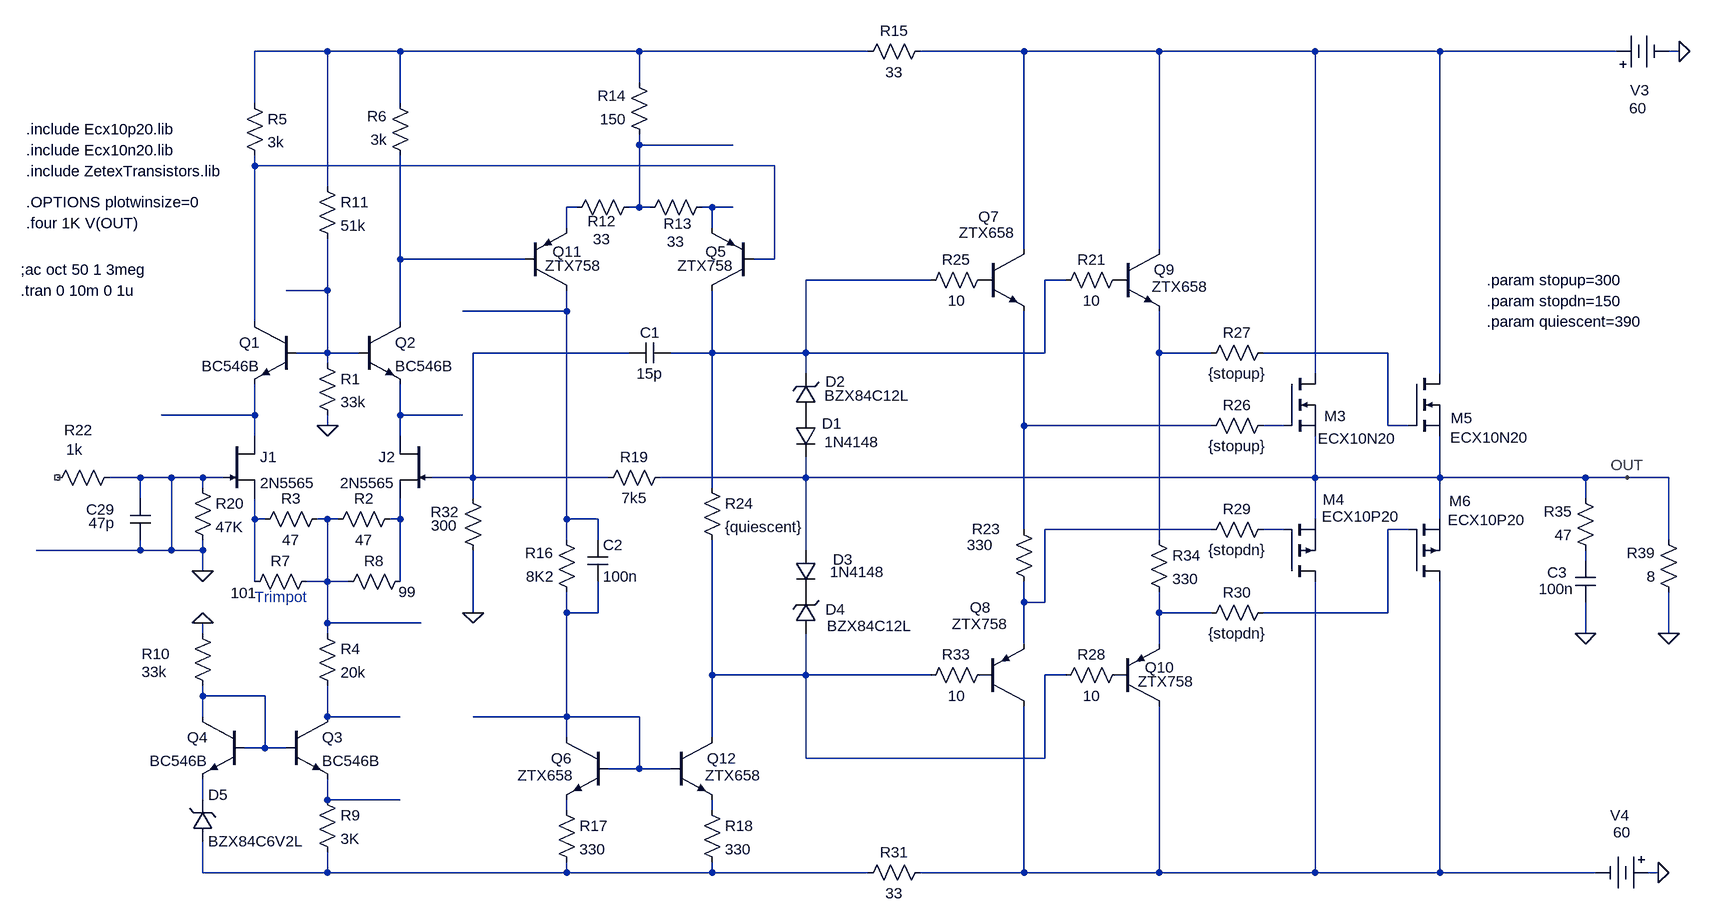
[diagram p0: schematic Zetex version amp 01.asc]
Zetex version amp 01.asc, the LTspice schematic file:
Version 4
SHEET 1 5568 1120
WIRE -224 -704 -336 -704
WIRE -112 -704 -224 -704
WIRE 256 -704 -112 -704
WIRE 608 -704 256 -704
WIRE 848 -704 688 -704
WIRE 1056 -704 848 -704
WIRE 1296 -704 1056 -704
WIRE 1488 -704 1296 -704
WIRE 1760 -704 1488 -704
WIRE 1856 -704 1840 -704
WIRE 256 -656 256 -704
WIRE -336 -624 -336 -704
WIRE -112 -624 -112 -704
WIRE 256 -560 256 -576
WIRE 400 -560 256 -560
WIRE -336 -528 -336 -544
WIRE 464 -528 -336 -528
WIRE -224 -496 -224 -704
WIRE 160 -464 144 -464
WIRE 256 -464 256 -560
WIRE 256 -464 240 -464
WIRE 272 -464 256 -464
WIRE 368 -464 352 -464
WIRE 400 -464 368 -464
WIRE 144 -432 144 -464
WIRE 368 -432 368 -464
WIRE 848 -400 848 -704
WIRE 1056 -400 1056 -704
WIRE -112 -384 -112 -544
WIRE 80 -384 -112 -384
WIRE 464 -384 464 -528
WIRE 464 -384 432 -384
WIRE 704 -352 512 -352
WIRE 912 -352 880 -352
WIRE -224 -336 -224 -416
WIRE -224 -336 -288 -336
WIRE 144 -304 144 -336
WIRE 144 -304 -16 -304
WIRE -336 -288 -336 -528
WIRE -112 -288 -112 -384
WIRE -224 -240 -224 -336
WIRE -224 -240 -272 -240
WIRE -176 -240 -224 -240
WIRE 240 -240 0 -240
WIRE 368 -240 368 -336
WIRE 368 -240 304 -240
WIRE 512 -240 512 -352
WIRE 512 -240 368 -240
WIRE 880 -240 880 -352
WIRE 880 -240 512 -240
WIRE 1056 -240 1056 -304
WIRE 1136 -240 1056 -240
WIRE 1408 -240 1216 -240
WIRE -224 -224 -224 -240
WIRE 512 -208 512 -240
WIRE 1296 -208 1296 -704
WIRE 1488 -208 1488 -704
WIRE -336 -144 -336 -192
WIRE -336 -144 -480 -144
WIRE -112 -144 -112 -192
WIRE -16 -144 -112 -144
WIRE -224 -128 -224 -144
WIRE 848 -128 848 -304
WIRE 1136 -128 848 -128
WIRE 1248 -128 1216 -128
WIRE 1408 -128 1408 -240
WIRE 1440 -128 1408 -128
WIRE -336 -112 -336 -144
WIRE -112 -112 -112 -144
WIRE -512 -48 -560 -48
WIRE -464 -48 -512 -48
WIRE -416 -48 -464 -48
WIRE -384 -48 -416 -48
WIRE 0 -48 0 -240
WIRE 0 -48 -64 -48
WIRE 208 -48 0 -48
WIRE 512 -48 512 -80
WIRE 512 -48 288 -48
WIRE 1296 -48 1296 -112
WIRE 1296 -48 512 -48
WIRE 1488 -48 1488 -112
WIRE 1488 -48 1296 -48
WIRE 1712 -48 1488 -48
WIRE 1776 -48 1712 -48
WIRE 1840 -48 1776 -48
WIRE -416 -32 -416 -48
WIRE 368 -32 368 -240
WIRE -512 -16 -512 -48
WIRE 0 -16 0 -48
WIRE 1712 -16 1712 -48
WIRE -336 16 -336 -16
WIRE -320 16 -336 16
WIRE -224 16 -240 16
WIRE -208 16 -224 16
WIRE -112 16 -112 -16
WIRE -112 16 -128 16
WIRE 144 16 144 -304
WIRE 192 16 144 16
WIRE 1296 16 1296 -48
WIRE 1488 16 1488 -48
WIRE 848 32 848 -128
WIRE 1136 32 880 32
WIRE 1248 32 1216 32
WIRE 1440 32 1408 32
WIRE 144 48 144 16
WIRE 192 48 192 16
WIRE 1056 48 1056 -240
WIRE 1840 48 1840 -48
WIRE -512 64 -512 48
WIRE -512 64 -672 64
WIRE -464 64 -464 -48
WIRE -464 64 -512 64
WIRE -416 64 -416 48
WIRE -416 64 -464 64
WIRE 512 64 512 -48
WIRE 1712 80 1712 64
WIRE -416 96 -416 64
WIRE -336 112 -336 16
WIRE -224 112 -224 16
WIRE -224 112 -256 112
WIRE -192 112 -224 112
WIRE -112 112 -112 16
WIRE 848 144 848 112
WIRE 880 144 880 32
WIRE 880 144 848 144
WIRE 0 160 0 64
WIRE 144 160 144 128
WIRE 192 160 192 112
WIRE 192 160 144 160
WIRE 1056 160 1056 128
WIRE 1136 160 1056 160
WIRE 1408 160 1408 32
WIRE 1408 160 1216 160
WIRE -224 176 -224 112
WIRE -80 176 -224 176
WIRE -416 192 -416 176
WIRE -224 192 -224 176
WIRE 1712 192 1712 144
WIRE 1840 192 1840 128
WIRE 848 208 848 144
WIRE 1056 208 1056 160
WIRE 368 256 368 48
WIRE 512 256 512 192
WIRE 512 256 368 256
WIRE 704 256 512 256
WIRE 912 256 880 256
WIRE -416 288 -416 272
WIRE -320 288 -416 288
WIRE -416 320 -416 288
WIRE -224 320 -224 272
WIRE -112 320 -224 320
WIRE 144 320 144 160
WIRE 144 320 0 320
WIRE 256 320 144 320
WIRE 144 352 144 320
WIRE 368 352 368 256
WIRE -320 368 -320 288
WIRE -320 368 -352 368
WIRE -288 368 -320 368
WIRE 512 384 512 256
WIRE 880 384 880 256
WIRE 880 384 512 384
WIRE 256 400 256 320
WIRE 256 400 208 400
WIRE 304 400 256 400
WIRE -416 448 -416 416
WIRE -224 448 -224 416
WIRE -112 448 -224 448
WIRE 144 464 144 448
WIRE 368 464 368 448
WIRE -416 560 -416 512
WIRE -224 560 -224 528
WIRE -224 560 -416 560
WIRE 144 560 144 544
WIRE 144 560 -224 560
WIRE 368 560 368 544
WIRE 368 560 144 560
WIRE 608 560 368 560
WIRE 848 560 848 304
WIRE 848 560 688 560
WIRE 1056 560 1056 304
WIRE 1056 560 848 560
WIRE 1296 560 1296 112
WIRE 1296 560 1056 560
WIRE 1488 560 1488 112
WIRE 1488 560 1296 560
WIRE 1728 560 1488 560
WIRE 1824 560 1808 560
FLAG -224 -128 0
FLAG -416 176 0
FLAG -416 96 0
FLAG 1856 -704 0
FLAG 1824 560 0
FLAG 1840 192 0
FLAG 0 160 0
FLAG 1776 -48 OUT
FLAG 1712 192 0
DATAFLAG 352 -704 ""
DATAFLAG 528 560 ""
DATAFLAG -144 320 ""
DATAFLAG 48 320 ""
DATAFLAG -144 448 ""
DATAFLAG -320 288 ""
DATAFLAG -112 176 ""
DATAFLAG 96 -48 ""
DATAFLAG -32 -144 ""
DATAFLAG -432 -144 ""
DATAFLAG 16 -528 ""
DATAFLAG -16 -384 ""
DATAFLAG -256 -336 ""
DATAFLAG 592 256 ""
DATAFLAG 640 -240 ""
DATAFLAG 944 -128 ""
DATAFLAG 960 32 ""
DATAFLAG 64 -304 ""
DATAFLAG 336 -560 ""
DATAFLAG 144 -464 ""
DATAFLAG 384 -464 ""
SYMBOL njf -64 -112 M0
SYMATTR InstName J2
SYMATTR Value 2N5565
SYMBOL npn -272 -288 M0
SYMATTR InstName Q1
SYMATTR Value BC546B
SYMBOL res -240 -240 R0
SYMATTR InstName R1
SYMATTR Value 33k
SYMBOL res -112 0 R90
WINDOW 0 0 56 VBottom 2
WINDOW 3 32 56 VTop 2
SYMATTR InstName R2
SYMATTR Value 47
SYMBOL res -224 0 R90
WINDOW 0 0 56 VBottom 2
WINDOW 3 32 56 VTop 2
SYMATTR InstName R3
SYMATTR Value 47
SYMBOL res -240 176 R0
SYMATTR InstName R4
SYMATTR Value 20k
SYMBOL res -352 -640 R0
SYMATTR InstName R5
SYMATTR Value 3k
SYMBOL res -96 -528 R180
WINDOW 0 36 76 Left 2
WINDOW 3 36 40 Left 2
SYMATTR InstName R6
SYMATTR Value 3k
SYMBOL res -240 96 R90
WINDOW 0 0 56 VBottom 2
WINDOW 3 18 113 VTop 2
SYMATTR InstName R7
SYMATTR Value 101
SYMBOL res -96 96 R90
WINDOW 0 0 56 VBottom 2
WINDOW 3 16 5 VTop 2
SYMATTR InstName R8
SYMATTR Value 99
SYMBOL npn -288 320 R0
SYMATTR InstName Q3
SYMATTR Value BC546B
SYMBOL res -240 432 R0
SYMATTR InstName R9
SYMATTR Value 3K
SYMBOL res -432 176 R0
WINDOW 0 -78 47 Left 2
WINDOW 3 -78 75 Left 2
SYMATTR InstName R10
SYMATTR Value 33k
SYMBOL res -240 -512 R0
SYMATTR InstName R11
SYMATTR Value 51k
SYMBOL res 256 -480 R90
WINDOW 0 53 58 VBottom 2
WINDOW 3 49 58 VTop 2
SYMATTR InstName R12
SYMATTR Value 33
SYMBOL res 256 -448 R270
WINDOW 0 -25 59 VTop 2
WINDOW 3 -21 56 VBottom 2
SYMATTR InstName R13
SYMATTR Value 33
SYMBOL res 272 -560 R180
WINDOW 0 36 76 Left 2
WINDOW 3 36 40 Left 2
SYMATTR InstName R14
SYMATTR Value 150
SYMBOL res 160 144 R180
WINDOW 0 36 76 Left 2
WINDOW 3 36 40 Left 2
SYMATTR InstName R16
SYMATTR Value 8K2
SYMBOL res 128 448 R0
SYMATTR InstName R17
SYMATTR Value 330
SYMBOL res 352 448 R0
SYMATTR InstName R18
SYMATTR Value 330
SYMBOL res 304 -64 R90
WINDOW 0 0 56 VBottom 2
WINDOW 3 32 56 VTop 2
SYMATTR InstName R19
SYMATTR Value 7k5
SYMBOL res -432 -48 R0
SYMATTR InstName R20
SYMATTR Value 47K
SYMBOL res -544 -64 R90
WINDOW 0 -42 63 VBottom 2
WINDOW 3 -43 69 VTop 2
SYMATTR InstName R22
SYMATTR Value 1k
SYMBOL res 832 16 R0
WINDOW 0 -64 15 Left 2
WINDOW 3 -72 40 Left 2
SYMATTR InstName R23
SYMATTR Value 330
SYMBOL res 352 -48 R0
SYMATTR InstName R24
SYMATTR Value {quiescent}
SYMBOL res 1120 -112 R270
WINDOW 0 32 56 VTop 2
WINDOW 3 0 56 VBottom 2
SYMATTR InstName R26
SYMATTR Value {stopup}
SYMBOL res 1120 -224 R270
WINDOW 0 32 56 VTop 2
WINDOW 3 0 56 VBottom 2
SYMATTR InstName R27
SYMATTR Value {stopup}
SYMBOL res 1120 48 R270
WINDOW 0 32 56 VTop 2
WINDOW 3 0 56 VBottom 2
SYMATTR InstName R29
SYMATTR Value {stopdn}
SYMBOL res 1120 176 R270
WINDOW 0 32 56 VTop 2
WINDOW 3 0 56 VBottom 2
SYMATTR InstName R30
SYMATTR Value {stopdn}
SYMBOL Misc\\battery 1744 -704 R270
WINDOW 123 0 0 Left 2
WINDOW 39 0 0 Left 2
WINDOW 0 -60 37 VRight 2
WINDOW 3 -87 35 VRight 2
SYMATTR InstName V3
SYMATTR Value 60
SYMBOL Misc\\battery 1824 560 R90
WINDOW 123 0 0 Left 2
WINDOW 39 0 0 Left 2
WINDOW 0 -88 45 VRight 2
WINDOW 3 -62 42 VRight 2
SYMATTR InstName V4
SYMATTR Value 60
SYMBOL njf -384 -112 R0
SYMATTR InstName J1
SYMATTR Value 2N5565
SYMBOL npn -352 320 M0
SYMATTR InstName Q4
SYMATTR Value BC546B
SYMBOL res 1856 144 R180
WINDOW 0 36 76 Left 2
WINDOW 3 36 40 Left 2
SYMATTR InstName R39
SYMATTR Value 8
SYMBOL npn -176 -288 R0
SYMATTR InstName Q2
SYMATTR Value BC546B
SYMBOL nmos 1248 -208 R0
WINDOW 3 52 100 Left 2
WINDOW 0 62 65 Left 2
SYMATTR Value ECX10N20
SYMATTR InstName M3
SYMATTR Prefix X
SYMBOL nmos 1440 -208 R0
WINDOW 0 65 68 Left 2
WINDOW 3 64 98 Left 2
SYMATTR InstName M5
SYMATTR Value ECX10N20
SYMATTR Prefix X
SYMBOL pmos 1248 112 M180
WINDOW 0 60 126 Left 2
WINDOW 3 58 100 Left 2
SYMATTR InstName M4
SYMATTR Value ECX10P20
SYMATTR Prefix X
SYMBOL pmos 1440 112 M180
WINDOW 0 62 124 Left 2
WINDOW 3 60 95 Left 2
SYMATTR InstName M6
SYMATTR Value ECX10P20
SYMATTR Prefix X
SYMBOL cap -496 48 R180
WINDOW 0 55 47 Left 2
WINDOW 3 55 26 Left 2
SYMATTR InstName C29
SYMATTR Value 47p
SYMBOL zener -432 512 M180
WINDOW 0 24 72 Left 2
WINDOW 3 24 0 Left 2
SYMATTR InstName D5
SYMATTR Value BZX84C6V2L
SYMATTR Description Diode
SYMATTR Type diode
SYMBOL res 704 -720 R90
WINDOW 0 0 56 VBottom 2
WINDOW 3 32 56 VTop 2
SYMATTR InstName R15
SYMATTR Value 33
SYMBOL res 704 544 R90
WINDOW 0 0 56 VBottom 2
WINDOW 3 32 56 VTop 2
SYMATTR InstName R31
SYMATTR Value 33
SYMBOL pnp 80 -336 M180
WINDOW 0 42 60 Left 2
WINDOW 3 31 38 Left 2
SYMATTR InstName Q11
SYMATTR Value ZTX758
SYMBOL npn 304 352 R0
WINDOW 3 53 58 Left 2
SYMATTR Value ZTX658
SYMATTR InstName Q12
SYMBOL diode 496 -144 R0
WINDOW 0 41 13 Left 2
WINDOW 3 45 41 Left 2
SYMATTR InstName D1
SYMATTR Value 1N4148
SYMBOL zener 528 -144 R180
WINDOW 0 -45 52 Left 2
WINDOW 3 -144 30 Left 2
SYMATTR InstName D2
SYMATTR Value BZX84C12L
SYMATTR Description Diode
SYMATTR Type diode
SYMBOL diode 496 64 R0
WINDOW 0 58 14 Left 2
WINDOW 3 53 33 Left 2
SYMATTR InstName D3
SYMATTR Value 1N4148
SYMBOL zener 528 192 R180
WINDOW 0 -45 37 Left 2
WINDOW 3 -148 12 Left 2
SYMATTR InstName D4
SYMATTR Value BZX84C12L
SYMATTR Description Diode
SYMATTR Type diode
SYMBOL res 16 80 R180
WINDOW 0 37 75 Left 2
WINDOW 3 40 54 Left 2
SYMATTR InstName R32
SYMATTR Value 300
SYMBOL pnp 432 -336 R180
WINDOW 0 42 60 Left 2
WINDOW 3 31 38 Left 2
SYMATTR InstName Q5
SYMATTR Value ZTX758
SYMBOL npn 208 352 M0
WINDOW 3 53 58 Left 2
SYMATTR Value ZTX658
SYMATTR InstName Q6
SYMBOL npn 784 -400 R0
WINDOW 3 -36 -25 Left 2
WINDOW 0 -6 -50 Left 2
SYMATTR Value ZTX658
SYMATTR InstName Q7
SYMBOL pnp 784 304 M180
WINDOW 0 -19 152 Left 2
WINDOW 3 -47 127 Left 2
SYMATTR InstName Q8
SYMATTR Value ZTX758
SYMBOL cap 304 -256 R90
WINDOW 0 0 32 VBottom 2
WINDOW 3 32 32 VTop 2
SYMATTR InstName C1
SYMATTR Value 15p
SYMBOL cap 176 48 R0
SYMATTR InstName C2
SYMATTR Value 100n
SYMBOL res 1008 -368 R90
WINDOW 0 0 56 VBottom 2
WINDOW 3 32 56 VTop 2
SYMATTR InstName R21
SYMATTR Value 10
SYMBOL npn 992 -400 R0
WINDOW 3 53 58 Left 2
SYMATTR Value ZTX658
SYMATTR InstName Q9
SYMBOL res 800 -368 R90
WINDOW 0 0 56 VBottom 2
WINDOW 3 32 56 VTop 2
SYMATTR InstName R25
SYMATTR Value 10
SYMBOL pnp 992 304 M180
WINDOW 0 42 60 Left 2
WINDOW 3 31 38 Left 2
SYMATTR InstName Q10
SYMATTR Value ZTX758
SYMBOL res 1008 240 R90
WINDOW 0 0 56 VBottom 2
WINDOW 3 32 56 VTop 2
SYMATTR InstName R28
SYMATTR Value 10
SYMBOL res 800 240 R90
WINDOW 0 0 56 VBottom 2
WINDOW 3 32 56 VTop 2
SYMATTR InstName R33
SYMATTR Value 10
SYMBOL res 1040 32 R0
SYMATTR InstName R34
SYMATTR Value 330
SYMBOL res 1728 80 R180
WINDOW 0 36 76 Left 2
WINDOW 3 36 40 Left 2
SYMATTR InstName R35
SYMATTR Value 47
SYMBOL cap 1696 80 R0
WINDOW 0 -43 18 Left 2
WINDOW 3 -56 43 Left 2
SYMATTR InstName C3
SYMATTR Value 100n
TEXT -696 -368 Left 2 !;ac oct 50 1 3meg
TEXT -696 -336 Left 2 !.tran 0 10m 0 1u
TEXT -688 -520 Left 2 !.include ZetexTransistors.lib
TEXT 1560 -352 Left 2 !.param stopup=300
TEXT 1560 -320 Left 2 !.param stopdn=150
TEXT 1560 -288 Left 2 !.param quiescent=390
TEXT -688 -552 Left 2 !.include Ecx10n20.lib
TEXT -688 -584 Left 2 !.include Ecx10p20.lib
TEXT -688 -440 Left 2 !.four 1K V(OUT)
TEXT -688 -472 Left 2 !.OPTIONS plotwinsize=0
TEXT -336 136 Left 2 ;Trimpot

The netlist it stands for:
* Zetex version amp 01.asc
J2 N015 N011 N020 2N5565
Q1 N004 N009 N014 0 BC546B
R1 N009 0 33k
R2 N020 N019 47
R3 N019 N018 47
R4 N019 N029 20k
R5 N001 N004 3k
R6 N007 N001 3k
R7 N019 N018 101
R8 N020 N019 99
Q3 N029 N028 N031 0 BC546B
R9 N031 N034 3K
R10 0 N028 33k
R11 N001 N009 51k
R12 N003 N005 33
R13 N003 N006 33
R14 N003 N001 150
R16 N025 N010 8K2
R17 N032 N034 330
R18 N033 N034 330
R19 OUT N011 7k5
R20 0 0 47K
R22 0 NC_01 1k
R23 N016 N021 330
R24 N008 N027 {quiescent}
R26 N016 N017 {stopup}
R27 N012 N013 {stopup}
R29 N021 N022 {stopdn}
R30 N026 N023 {stopdn}
V3 N002 0 60
V4 0 N035 60
J1 N014 0 N018 2N5565
Q4 N028 N028 N030 0 BC546B
R39 0 OUT 8
Q2 N007 N009 N015 0 BC546B
XM3 N002 N017 OUT ECX10N20  ; pins D G S
XM5 N002 N013 OUT ECX10N20  ; pins D G S
XM4 N035 N022 OUT ECX10P20  ; pins D G S
XM6 N035 N023 OUT ECX10P20  ; pins D G S
C29 0 0 47p
D5 N034 N030 BZX84C6V2L
R15 N002 N001 33
R31 N035 N034 33
Q11 N010 N007 N005 0 ZTX758
Q12 N027 N025 N033 0 ZTX658
D1 P001 OUT 1N4148
D2 P001 N008 BZX84C12L
D3 OUT P002 1N4148
D4 N027 P002 BZX84C12L
R32 0 N011 300
Q5 N008 N004 N006 0 ZTX758
Q6 N025 N025 N032 0 ZTX658
Q7 N002 P003 N016 0 ZTX658
Q8 N035 P004 N021 0 ZTX758
C1 N008 N011 15p
C2 N010 N025 100n
R21 P005 N008 10
Q9 N002 P005 N012 0 ZTX658
R25 P003 N008 10
Q10 N035 P006 N026 0 ZTX758
R28 P006 N027 10
R33 P004 N027 10
R34 N012 N026 330
R35 N024 OUT 47
C3 N024 0 100n
.model D D
.lib standard.dio
.model NPN NPN
.model PNP PNP
.lib standard.bjt
.model NJF NJF
.model PJF PJF
.lib standard.jft
;ac oct 50 1 3meg
.tran 0 10m 0 1u
.include ZetexTransistors.lib
.param stopup=300
.param stopdn=150
.param quiescent=390
.include Ecx10n20.lib
.include Ecx10p20.lib
.four 1K V(OUT)
.OPTIONS plotwinsize=0
* Trimpot
.backanno
.end